# Altium schematic sheet POWER_REFERENCE_BLOCK.SchDoc
size 594 x 420 mm
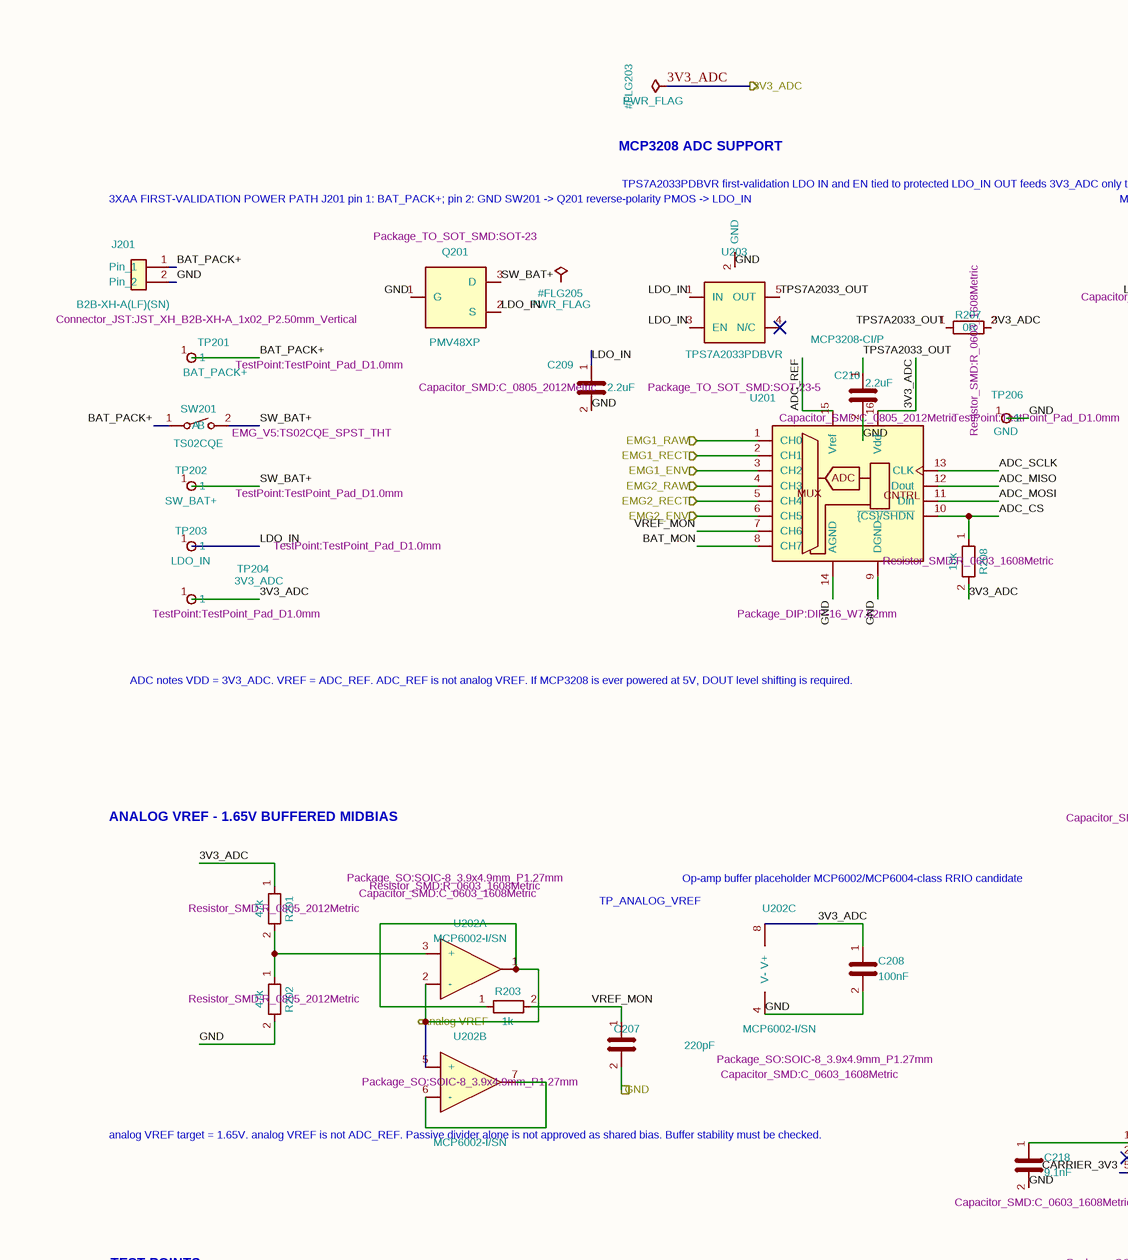
[diagram p0: POWER_REFERENCE_BLOCK.SchDoc, top left]
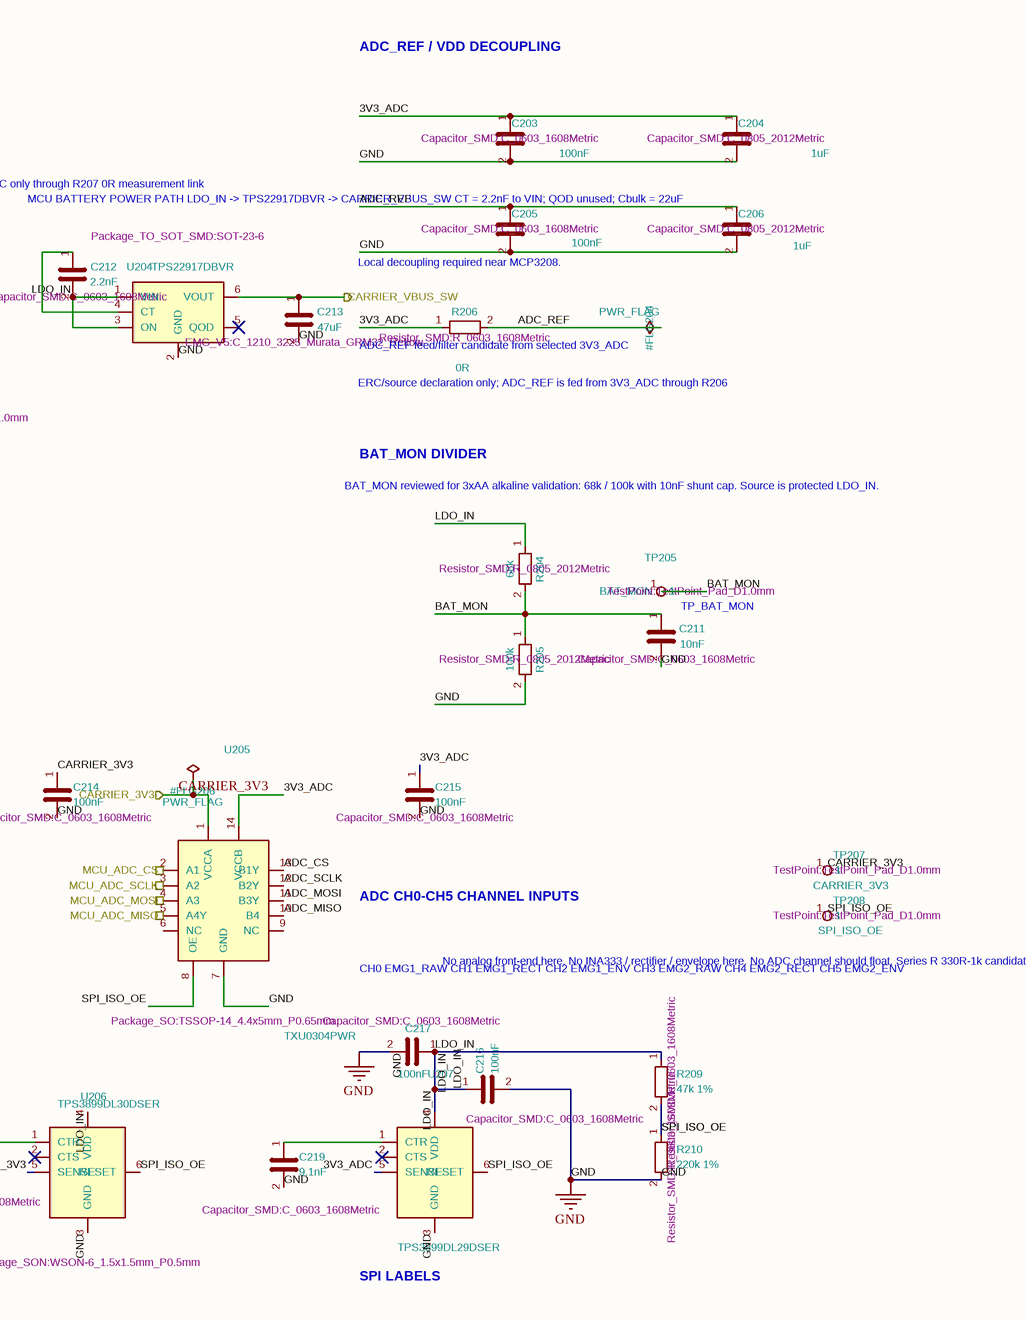
[diagram p1: POWER_REFERENCE_BLOCK.SchDoc, top right]
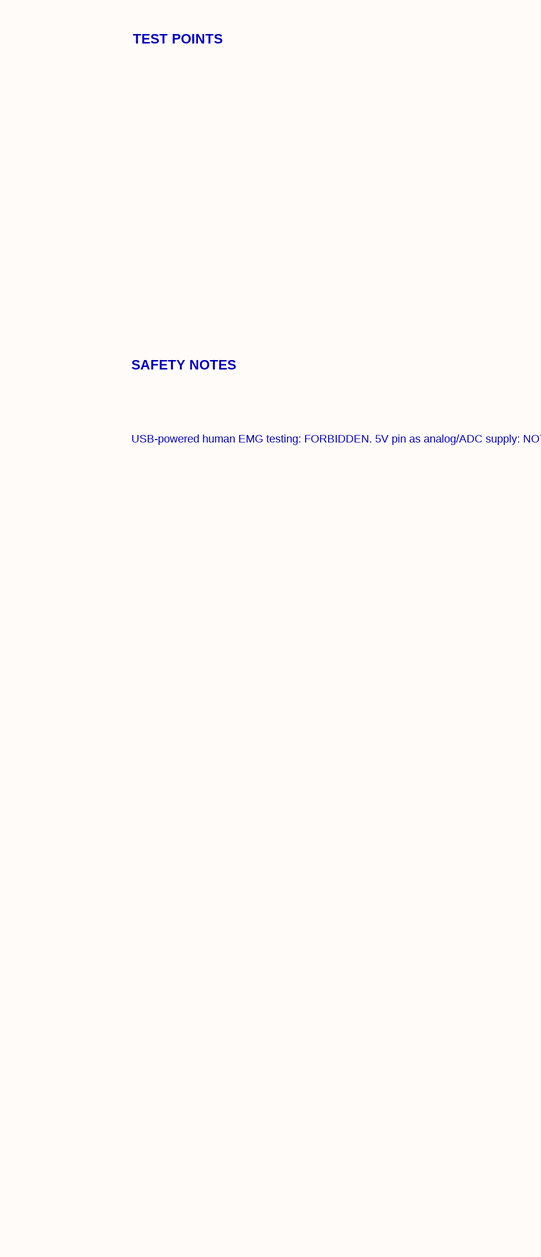
[diagram p2: POWER_REFERENCE_BLOCK.SchDoc, bottom left]
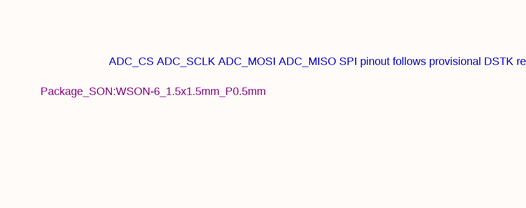
[diagram p3: POWER_REFERENCE_BLOCK.SchDoc, bottom right]

## Parts
#FLG203  PWR_FLAG  (graphical)
#FLG204  PWR_FLAG  (graphical)
#FLG205  PWR_FLAG  (graphical)
#FLG206  PWR_FLAG  (graphical)
C203  Footprint: Capacitor_SMD:C_0603_1608Metric  [C_0603_1608Metric]  (hidden comment: 100nF)
C204  Footprint: Capacitor_SMD:C_0805_2012Metric  [C_0805_2012Metric]  (hidden comment: 1uF)
C205  Footprint: Capacitor_SMD:C_0603_1608Metric  [C_0603_1608Metric]  (hidden comment: 100nF)
C206  Footprint: Capacitor_SMD:C_0805_2012Metric  [C_0805_2012Metric]  (hidden comment: 1uF)
C207  Footprint: Capacitor_SMD:C_0603_1608Metric  [C_0603_1608Metric]  (hidden comment: 220pF)
C208  Footprint: Capacitor_SMD:C_0603_1608Metric  [C_0603_1608Metric]  (hidden comment: 100nF)
C209  Footprint: Capacitor_SMD:C_0805_2012Metric  [C_0805_2012Metric]  (hidden comment: 2.2uF)
C210  Footprint: Capacitor_SMD:C_0805_2012Metric  [C_0805_2012Metric]  (hidden comment: 2.2uF)
C211  Footprint: Capacitor_SMD:C_0603_1608Metric  [C_0603_1608Metric]  (hidden comment: 10nF)
C212  Footprint: Capacitor_SMD:C_0603_1608Metric  [C_0603_1608Metric]  (hidden comment: 2.2nF)
C213  Footprint: EMG_V5:C_1210_3225_Murata_GRM32_Reflow  [C_1210_3225_Murata_GRM32_Reflow]  (hidden comment: 47uF)
C214  Footprint: Capacitor_SMD:C_0603_1608Metric  [C_0603_1608Metric]  (hidden comment: 100nF)
C215  Footprint: Capacitor_SMD:C_0603_1608Metric  [C_0603_1608Metric]  (hidden comment: 100nF)
C216  Footprint: Capacitor_SMD:C_0603_1608Metric  [C_0603_1608Metric]  (hidden comment: 100nF)
C217  Footprint: Capacitor_SMD:C_0603_1608Metric  [C_0603_1608Metric]  (hidden comment: 100nF)
C218  Footprint: Capacitor_SMD:C_0603_1608Metric  [C_0603_1608Metric]  (hidden comment: 9.1nF)
C219  Footprint: Capacitor_SMD:C_0603_1608Metric  [C_0603_1608Metric]  (hidden comment: 9.1nF)
J201  Footprint: Connector_JST:JST_XH_B2B-XH-A_1x02_P2.50mm_Vertical  [JST_XH_B2B-XH-A_1x02_P2.50mm_Vertical]  (hidden comment: B2B-XH-A(LF)(SN))
Q201  Footprint: Package_TO_SOT_SMD:SOT-23  [SOT-23]  (hidden comment: PMV48XP)
R201  Footprint: Resistor_SMD:R_0805_2012Metric  [R_0805_2012Metric]  (hidden comment: 47k)
R202  Footprint: Resistor_SMD:R_0805_2012Metric  [R_0805_2012Metric]  (hidden comment: 47k)
R203  Footprint: Resistor_SMD:R_0603_1608Metric  [R_0603_1608Metric]  (hidden comment: 1k)
R204  Footprint: Resistor_SMD:R_0805_2012Metric  [R_0805_2012Metric]  (hidden comment: 68k)
R205  Footprint: Resistor_SMD:R_0805_2012Metric  [R_0805_2012Metric]  (hidden comment: 100k)
R206  Footprint: Resistor_SMD:R_0603_1608Metric  [R_0603_1608Metric]  (hidden comment: 0R)
R207  Footprint: Resistor_SMD:R_0603_1608Metric  [R_0603_1608Metric]  (hidden comment: 0R)
R208  Footprint: Resistor_SMD:R_0603_1608Metric  [R_0603_1608Metric]  (hidden comment: 10k)
R209  Footprint: Resistor_SMD:R_0603_1608Metric  [R_0603_1608Metric]  (hidden comment: 47k 1%)
R210  Footprint: Resistor_SMD:R_0603_1608Metric  [R_0603_1608Metric]  (hidden comment: 220k 1%)
SW201  Footprint: EMG_V5:TS02CQE_SPST_THT  [TS02CQE_SPST_THT]  (hidden comment: TS02CQE)
TP201  Footprint: TestPoint:TestPoint_Pad_D1.0mm  [TestPoint_Pad_D1.0mm]  (hidden comment: BAT_PACK+)
TP202  Footprint: TestPoint:TestPoint_Pad_D1.0mm  [TestPoint_Pad_D1.0mm]  (hidden comment: SW_BAT+)
TP203  Footprint: TestPoint:TestPoint_Pad_D1.0mm  [TestPoint_Pad_D1.0mm]  (hidden comment: LDO_IN)
TP204  Footprint: TestPoint:TestPoint_Pad_D1.0mm  [TestPoint_Pad_D1.0mm]  (hidden comment: 3V3_ADC)
TP205  Footprint: TestPoint:TestPoint_Pad_D1.0mm  [TestPoint_Pad_D1.0mm]  (hidden comment: BAT_MON)
TP206  Footprint: TestPoint:TestPoint_Pad_D1.0mm  [TestPoint_Pad_D1.0mm]  (hidden comment: GND)
TP207  Footprint: TestPoint:TestPoint_Pad_D1.0mm  [TestPoint_Pad_D1.0mm]  (hidden comment: CARRIER_3V3)
TP208  Footprint: TestPoint:TestPoint_Pad_D1.0mm  [TestPoint_Pad_D1.0mm]  (hidden comment: SPI_ISO_OE)
U201  Footprint: Package_DIP:DIP-16_W7.62mm  [DIP-16_W7.62mm]  (hidden comment: MCP3208-CI/P)
U202  Footprint: Package_SO:SOIC-8_3.9x4.9mm_P1.27mm  [SOIC-8_3.9x4.9mm_P1.27mm]  (hidden comment: MCP6002-I/SN)  (parts A,B,C of 3)
U203  Footprint: Package_TO_SOT_SMD:SOT-23-5  [SOT-23-5]  (hidden comment: TPS7A2033PDBVR)
U204  Footprint: Package_TO_SOT_SMD:SOT-23-6  [SOT-23-6]  (hidden comment: TPS22917DBVR)
U205  Footprint: Package_SO:TSSOP-14_4.4x5mm_P0.65mm  [TSSOP-14_4.4x5mm_P0.65mm]  (hidden comment: TXU0304PWR)
U206  Footprint: Package_SON:WSON-6_1.5x1.5mm_P0.5mm  [WSON-6_1.5x1.5mm_P0.5mm]  (hidden comment: TPS3899DL30DSER)
U207  Footprint: Package_SON:WSON-6_1.5x1.5mm_P0.5mm  [WSON-6_1.5x1.5mm_P0.5mm]  (hidden comment: TPS3899DL29DSER)

## Ports
3V3_ADC (out), analog VREF (out), CARRIER_3V3 (in), CARRIER_VBUS_SW (out), EMG1_ENV (in), EMG1_RAW (in), EMG1_RECT (in), EMG2_ENV (in), EMG2_RAW (in), EMG2_RECT (in), GND, MCU_ADC_CS (in), MCU_ADC_MISO (out), MCU_ADC_MOSI (in), MCU_ADC_SCLK (in)

## Nets
GND: C203.2 C204.2 C205.2 C206.2 C208.2 C209.2 C210.2 C211.2 C213.2 C214.2 C215.2 C216.2 C217.2 C218.2 C219.2 J201.2(Pin_2) Q201.1(G) R202.2 R205.2 R210.2 TP206.1 U201.9(DGND) U201.14(AGND) U202.4(V-) U203.2(GND) U204.2(GND) U205.7(GND) U206.3(GND) U207.3(GND)
3V3_ADC: #FLG203.1 C203.1 C204.1 C208.1 C215.1 R201.1 R206.1 R207.2 R208.2 TP204.1 U201.16(Vdd) U202.8(V+) U205.14(VCCB) U207.5(SENSE) ; port 3V3_ADC
ADC_CS: R208.1 U201.10(~{{CS}/SHDN}) U205.13(B1Y)
ADC_MISO: U201.12(Dout) U205.10(B4)
ADC_MOSI: U201.11(Din) U205.11(B3Y)
ADC_REF: #FLG204.1 C205.1 C206.1 R206.2 U201.15(Vref)
ADC_SCLK: U201.13(CLK) U205.12(B2Y)
analog VREF: R203.1 U202.1 U202.2(-) U202.5(+) ; port analog VREF
BAT_MON: C211.1 R204.2 R205.1 TP205.1 U201.8(CH7)
BAT_PACK+: J201.1(Pin_1) SW201.1(A) TP201.1
CARRIER_3V3: #FLG206.1 C214.1 TP207.1 U205.1(VCCA) U206.5(SENSE) ; port CARRIER_3V3
CARRIER_VBUS_SW: C213.1 U204.6(VOUT) ; port CARRIER_VBUS_SW
EMG1_ENV: U201.3(CH2) ; port EMG1_ENV
EMG1_RAW: U201.1(CH0) ; port EMG1_RAW
EMG1_RECT: U201.2(CH1) ; port EMG1_RECT
EMG2_ENV: U201.6(CH5) ; port EMG2_ENV
EMG2_RAW: U201.4(CH3) ; port EMG2_RAW
EMG2_RECT: U201.5(CH4) ; port EMG2_RECT
GND: C207.2 ; port GND  [a separate net that carries the same name]
LDO_IN: C209.1 C212.2 C216.1 C217.1 Q201.2(S) R204.1 R209.1 TP203.1 U203.1(IN) U203.3(EN) U204.1(VIN) U204.3(ON) U206.4(VDD) U207.4(VDD)
MCU_ADC_CS: U205.2(A1) ; port MCU_ADC_CS
MCU_ADC_MISO: U205.5(A4Y) ; port MCU_ADC_MISO
MCU_ADC_MOSI: U205.4(A3) ; port MCU_ADC_MOSI
MCU_ADC_SCLK: U205.3(A2) ; port MCU_ADC_SCLK
SPI_ISO_OE: R209.2 R210.1 TP208.1 U205.8(OE) U206.6(RESET) U207.6(RESET)
SW_BAT+: Q201.3(D) SW201.2(B) TP202.1
TPS7A2033_OUT: C210.1 R207.1 U203.5(OUT)
VREF_MON: C207.1 R203.2 U201.7(CH6)
NetC212_1: C212.1 U204.4(CT)
NetC218_1: C218.1 U206.1(CTR)
NetC219_1: C219.1 U207.1(CTR)
NetR201_2: R201.2 R202.1 U202.3(+)
NetU202_6: U202.6(-) U202.7

Not connected (* = marked no-connect by the designer): #FLG205 1; U203 4(N/C)*; U204 5(QOD)*; U205 6(NC) 9(NC); U206 2(CTS)*; U207 2(CTS)*

## Notes on the sheet
- ADC_REF / VDD DECOUPLING
- 3XAA FIRST-VALIDATION POWER PATH
  J201 pin 1: BAT_PACK+; pin 2: GND
  SW201 -> Q201 reverse-polarity PMOS -> LDO_IN
- (near #FLG203) MCP3208 ADC SUPPORT
- TPS7A2033PDBVR first-validation LDO
  IN and EN tied to protected LDO_IN
  OUT feeds 3V3_ADC only through R207 0R measurement link
- (near C205) MCU BATTERY POWER PATH
  LDO_IN -> TPS22917DBVR -> CARRIER_VBUS_SW
  CT = 2.2nF to VIN; QOD unused; Cbulk = 22uF
- (near C205) Local decoupling required near MCP3208.
- (near R206) ADC_REF feed/filter candidate from selected 3V3_ADC
- ERC/source declaration only; ADC_REF is fed from 3V3_ADC through R206
- BAT_MON reviewed for 3xAA alkaline validation: 68k / 100k with 10nF shunt cap. Source is protected LDO_IN.
- BAT_MON DIVIDER
- TP_BAT_MON
- ADC notes
  VDD = 3V3_ADC.
  VREF = ADC_REF.
  ADC_REF is not analog VREF.
  If MCP3208 is ever powered at 5V,
  DOUT level shifting is required.
- ANALOG VREF - 1.65V BUFFERED MIDBIAS
- Op-amp buffer placeholder
  MCP6002/MCP6004-class RRIO candidate
- TP_ANALOG_VREF
- ADC CH0-CH5 CHANNEL INPUTS
- (near TP208) No analog front-end here.
  No INA333 / rectifier / envelope here.
  No ADC channel should float.
  Series R 330R-1k candidate.
  C candidates: RAW/RECT 100pF-1nF, ENV 1nF-10nF.
- CH0 EMG1_RAW
  CH1 EMG1_RECT
  CH2 EMG1_ENV
  CH3 EMG2_RAW
  CH4 EMG2_RECT
  CH5 EMG2_ENV
- (near U202) analog VREF target = 1.65V.
  analog VREF is not ADC_REF.
  Passive divider alone is not approved as shared bias.
  Buffer stability must be checked.
- TEST POINTS
- (near U207) SPI LABELS
- ADC_CS
  ADC_SCLK
  ADC_MOSI
  ADC_MISO
  SPI pinout follows provisional DSTK review.
  Do not connect to DSTK in this task.
- SAFETY NOTES
- USB-powered human EMG testing: FORBIDDEN.
  5V pin as analog/ADC supply: NOT APPROVED.
  3V3 external powering of DSTK22807: NOT APPROVED YET.
  Battery-powered isolated operation required for human-contact testing.
  This is not a certified medical device.
  Do not use earth-referenced equipment while electrodes are attached to a human.
- 1
- 2
- 3
- 4
- 5
- 6
- 7
- 8
- 9
- 10
- 11
- A
- B
- C
- D
- E
- F
- G
- H
- Title:
- File: POWER_REFERENCE_BLOCK.kicad_sch
- Sheet: /
- KiCad E.D.A.  kicad (5.1.4)-1
- Size: A2
- Date:
- Rev:
- Id: 1/1
- (in symbol MCP3208) ADC; MUX; CNTRL

## Library data of the parts
C203-C219 = C
  C203 C205 C208 C214-C217: Value: 100nF
  C204 C206: Value: 1uF
  C207: Value: 220pF
  C209 C210: Value: 2.2uF
  C211: Value: 10nF
  C212: Value: 2.2nF
  C213: Value: 47uF
  C218 C219: Value: 9.1nF
J201 = EMG_Conn_01x02_Pin: Value: B2B-XH-A(LF)(SN)
R201-R210 = R
  R201 R202: Value: 47k
  R203: Value: 1k
  R204: Value: 68k
  R205: Value: 100k
  R206 R207: Value: 0R
  R208: Value: 10k
  R209: Value: 47k 1%
  R210: Value: 220k 1%
SW201 = EMG_SW_SPST: Value: TS02CQE
TP201 TP207 TP208 = EMG_TestPoint_1
  TP201: Value: BAT_PACK+
  TP207: Value: CARRIER_3V3
  TP208: Value: SPI_ISO_OE
TP202 = EMG_TestPoint_2: Value: SW_BAT+
TP203 = EMG_TestPoint_3: Value: LDO_IN
TP204 = EMG_TestPoint_4: Value: 3V3_ADC
TP205 = EMG_TestPoint_5: Value: BAT_MON
TP206 = EMG_TestPoint: Value: GND
U201 = MCP3208: Value: MCP3208-CI/P
U202 = MCP6002-xP: Value: MCP6002-I/SN
U204 = TPS22917DBV: Value: TPS22917DBVR
U205 = TXU0304PWR_1: Value: TXU0304PWR
U206 U207 = TPS3899DL_DSE_1
  U206: Value: TPS3899DL30DSER
  U207: Value: TPS3899DL29DSER
#FLG203-#FLG206 = PWR_FLAG: Value: PWR_FLAG
Q201 = PMV48XP: Value: PMV48XP
U203 = TPS7A2033PDBVR: Value: TPS7A2033PDBVR